# EAGLE design GTIA2DVI (EAGLE 9.6.2)
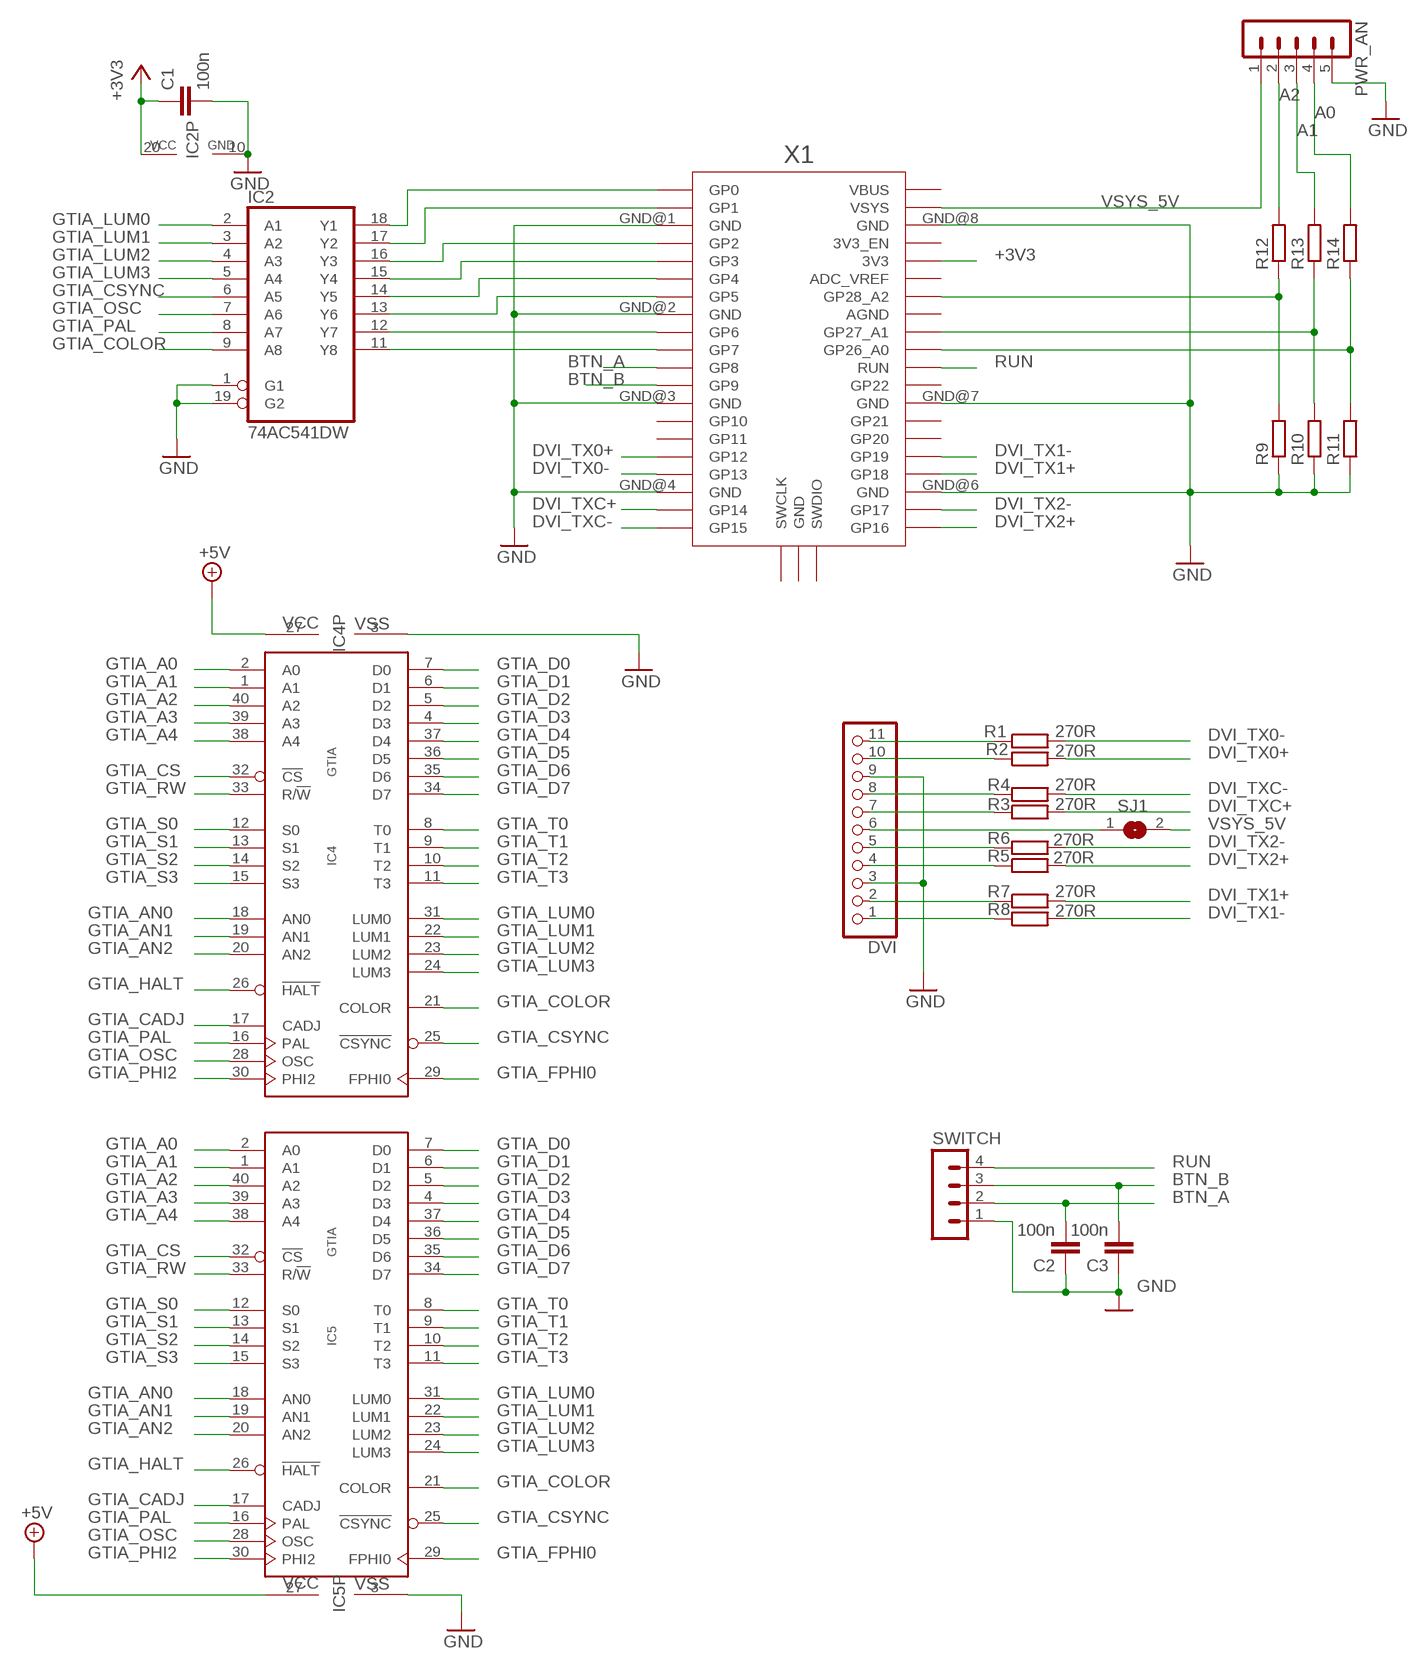
[diagram p0: schematic, sheet 1]

## Parts
C1  100n  C-EUC0805  [C0805]
C2  100n  C-EUC0805  [C0805]
C3  100n  C-EUC0805  [C0805]
DVI  PINHD-1X11  [1X11]
IC2  74AC541DW  [SO20W]
IC4  GTIA  [DIL40]
IC5  GTIA  [DIL40]
PWR_AN  MA05-1  [MA05-1]
R1  270R  R-EU_M0805  [M0805]
R2  270R  R-EU_M0805  [M0805]
R3  270R  R-EU_M0805  [M0805]
R4  270R  R-EU_M0805  [M0805]
R5  270R  R-EU_M0805  [M0805]
R6  270R  R-EU_M0805  [M0805]
R7  270R  R-EU_M0805  [M0805]
R8  270R  R-EU_M0805  [M0805]
R9  R-EU_M0805  [M0805]
R10  R-EU_M0805  [M0805]
R11  R-EU_M0805  [M0805]
R12  R-EU_M0805  [M0805]
R13  R-EU_M0805  [M0805]
R14  R-EU_M0805  [M0805]
SJ1  SJ  [SJ]
SWITCH  MA04-1  [MA04-1]
X1  RPI_PICO_IG-TH  [RPI_PICO_TH]

## Nets
+3V3: C1.1 IC2.20(VCC) X1.3V3
+5V: IC4.27(VCC) IC5.27(VCC)
A0: PWR_AN.4 R14.2
A1: PWR_AN.3 R13.2
A2: PWR_AN.2 R12.2
BTN_A: C2.2 SWITCH.2 X1.GP8
BTN_B: C3.2 SWITCH.3 X1.GP9
DVI_TX0+: R2.2 X1.GP12
DVI_TX0-: R1.2 X1.GP13
DVI_TX1+: R7.2 X1.GP18
DVI_TX1-: R8.2 X1.GP19
DVI_TX2+: R5.2 X1.GP16
DVI_TX2-: R6.2 X1.GP17
DVI_TXC+: R3.2 X1.GP14
DVI_TXC-: R4.2 X1.GP15
GND: C1.2 C2.1 C3.1 DVI.3 DVI.9 IC2.1(G1) IC2.10(GND) IC2.19(G2) IC4.3(VSS) IC5.3(VSS) PWR_AN.5 R9.1 R10.1 R11.1 SWITCH.1 X1.GND@1(GND) X1.GND@2(GND) X1.GND@3(GND) X1.GND@4(GND) X1.GND@6(GND) X1.GND@7(GND) X1.GND@8(GND)
GP0: IC2.18(Y1) X1.GP0
GP1: IC2.17(Y2) X1.GP1
GP2: IC2.16(Y3) X1.GP2
GP3: IC2.15(Y4) X1.GP3
GP4: IC2.14(Y5) X1.GP4
GP5: IC2.13(Y6) X1.GP5
GP6: IC2.12(Y7) X1.GP6
GP7: IC2.11(Y8) X1.GP7
GTIA_A0: IC4.2(A0) IC5.2(A0)
GTIA_A1: IC4.1(A1) IC5.1(A1)
GTIA_A2: IC4.40(A2) IC5.40(A2)
GTIA_A3: IC4.39(A3) IC5.39(A3)
GTIA_A4: IC4.38(A4) IC5.38(A4)
GTIA_AN0: IC4.18(AN0) IC5.18(AN0)
GTIA_AN1: IC4.19(AN1) IC5.19(AN1)
GTIA_AN2: IC4.20(AN2) IC5.20(AN2)
GTIA_CADJ: IC4.17(CADJ) IC5.17(CADJ)
GTIA_COLOR: IC2.9(A8) IC4.21(COLOR) IC5.21(COLOR)
GTIA_CS: IC4.32(!CS) IC5.32(!CS)
GTIA_CSYNC: IC2.6(A5) IC4.25(!CSYNC) IC5.25(!CSYNC)
GTIA_D0: IC4.7(D0) IC5.7(D0)
GTIA_D1: IC4.6(D1) IC5.6(D1)
GTIA_D2: IC4.5(D2) IC5.5(D2)
GTIA_D3: IC4.4(D3) IC5.4(D3)
GTIA_D4: IC4.37(D4) IC5.37(D4)
GTIA_D5: IC4.36(D5) IC5.36(D5)
GTIA_D6: IC4.35(D6) IC5.35(D6)
GTIA_D7: IC4.34(D7) IC5.34(D7)
GTIA_FPHI0: IC4.29(FPHI0) IC5.29(FPHI0)
GTIA_HALT: IC4.26(!HALT) IC5.26(!HALT)
GTIA_LUM0: IC2.2(A1) IC4.31(LUM0) IC5.31(LUM0)
GTIA_LUM1: IC2.3(A2) IC4.22(LUM1) IC5.22(LUM1)
GTIA_LUM2: IC2.4(A3) IC4.23(LUM2) IC5.23(LUM2)
GTIA_LUM3: IC2.5(A4) IC4.24(LUM3) IC5.24(LUM3)
GTIA_OSC: IC2.7(A6) IC4.28(OSC) IC5.28(OSC)
GTIA_PAL: IC2.8(A7) IC4.16(PAL) IC5.16(PAL)
GTIA_PHI2: IC4.30(PHI2) IC5.30(PHI2)
GTIA_RW: IC4.33(R/!W) IC5.33(R/!W)
GTIA_S0: IC4.12(S0) IC5.12(S0)
GTIA_S1: IC4.13(S1) IC5.13(S1)
GTIA_S2: IC4.14(S2) IC5.14(S2)
GTIA_S3: IC4.15(S3) IC5.15(S3)
GTIA_T0: IC4.8(T0) IC5.8(T0)
GTIA_T1: IC4.9(T1) IC5.9(T1)
GTIA_T2: IC4.10(T2) IC5.10(T2)
GTIA_T3: IC4.11(T3) IC5.11(T3)
N$1: DVI.11 R1.1
N$2: DVI.10 R2.1
N$3: DVI.8 R4.1
N$4: DVI.7 R3.1
N$5: DVI.5 R6.1
N$6: DVI.4 R5.1
N$7: DVI.2 R7.1
N$8: DVI.1 R8.1
N$18: R9.2 R12.1 X1.GP28_A2
N$19: R10.2 R13.1 X1.GP27_A1
N$20: R11.2 R14.1 X1.GP26_A0
RUN: SWITCH.4 X1.RUN
VSYS_5V: DVI.6 PWR_AN.1 SJ1.1 SJ1.2 X1.VSYS
Unconnected: X1.3V3_EN X1.ADC_VREF X1.AGND X1.GND@5(GND) X1.GP10 X1.GP11 X1.GP20 X1.GP21 X1.GP22 X1.SWCLK X1.SWDIO X1.VBUS

## Library data of the parts
C1-C3 = rcl:C-EU: CAPACITOR, European symbol; SPICEPREFIX: C
DVI = pinhead:PINHD-1X11: PIN HEADER
IC2 = 74xx-eu:74*541: Octal BUFFER and LINE DRIVER, 3-state
IC4 IC5 = eagle-6.5.0-atari:GTIA: GTIA
PWR_AN = con-lstb:MA05-1: PIN HEADER; OC_FARNELL: unknown; OC_NEWARK: unknown
R1-R14 = rcl:R-EU_: RESISTOR, European symbol; SPICEPREFIX: R
SJ1 = jumper:SJ: SMD solder JUMPER
SWITCH = con-lstb:MA04-1: PIN HEADER; OC_FARNELL: unknown; OC_NEWARK: unknown
X1 = RaspberryPi_Pico:RPI_PICO_IG

## Board
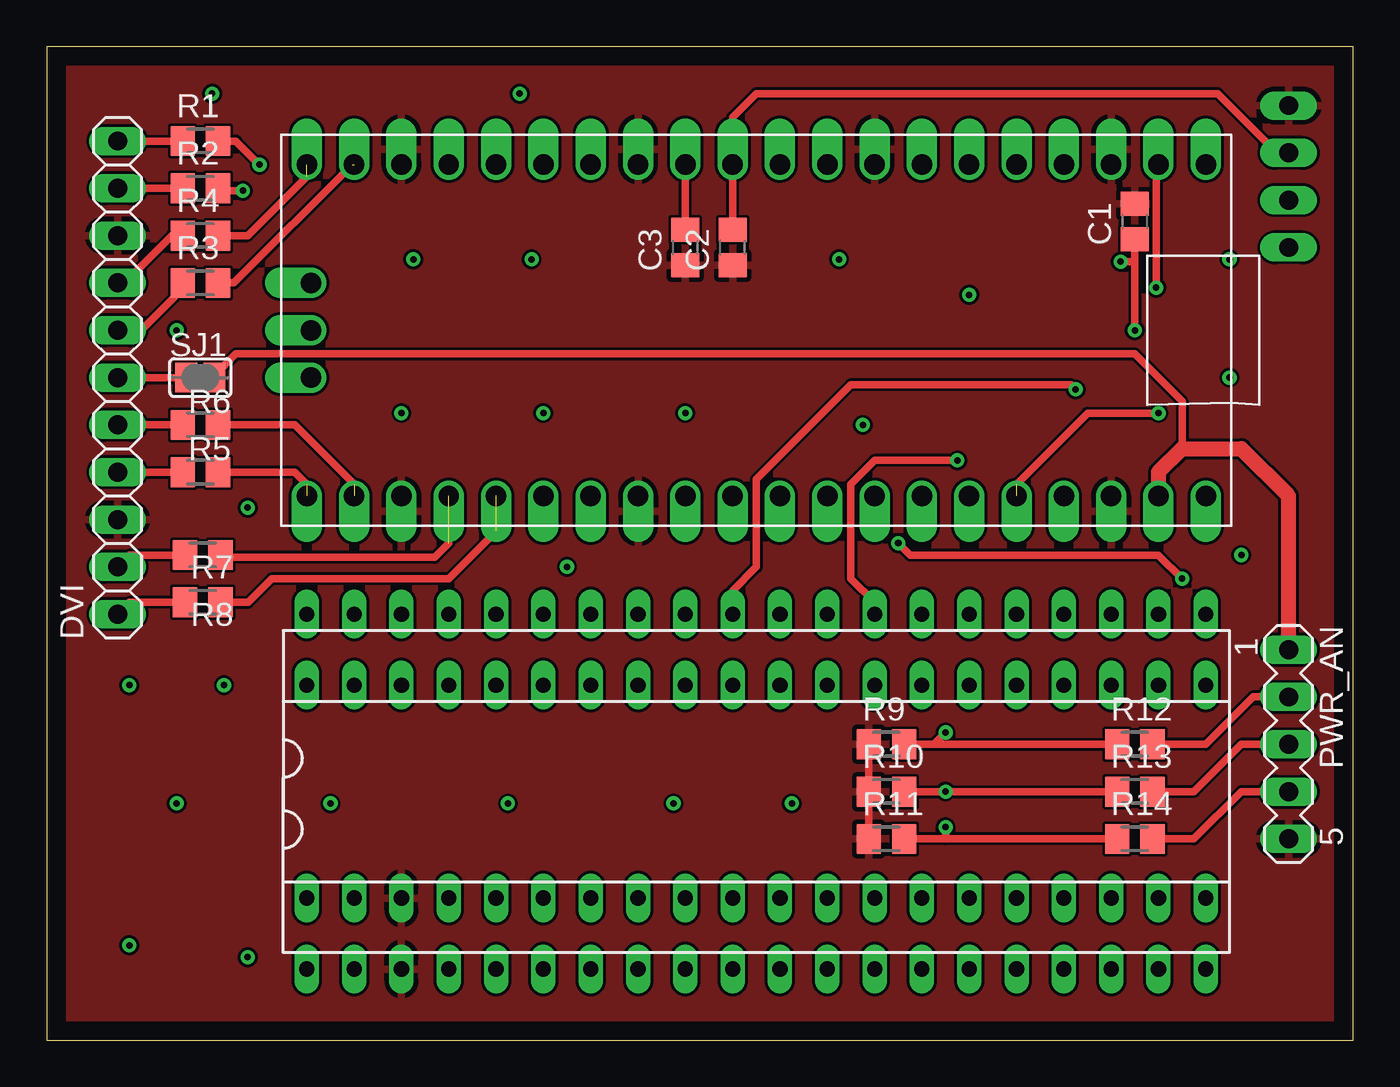
[diagram p1: board, top side]
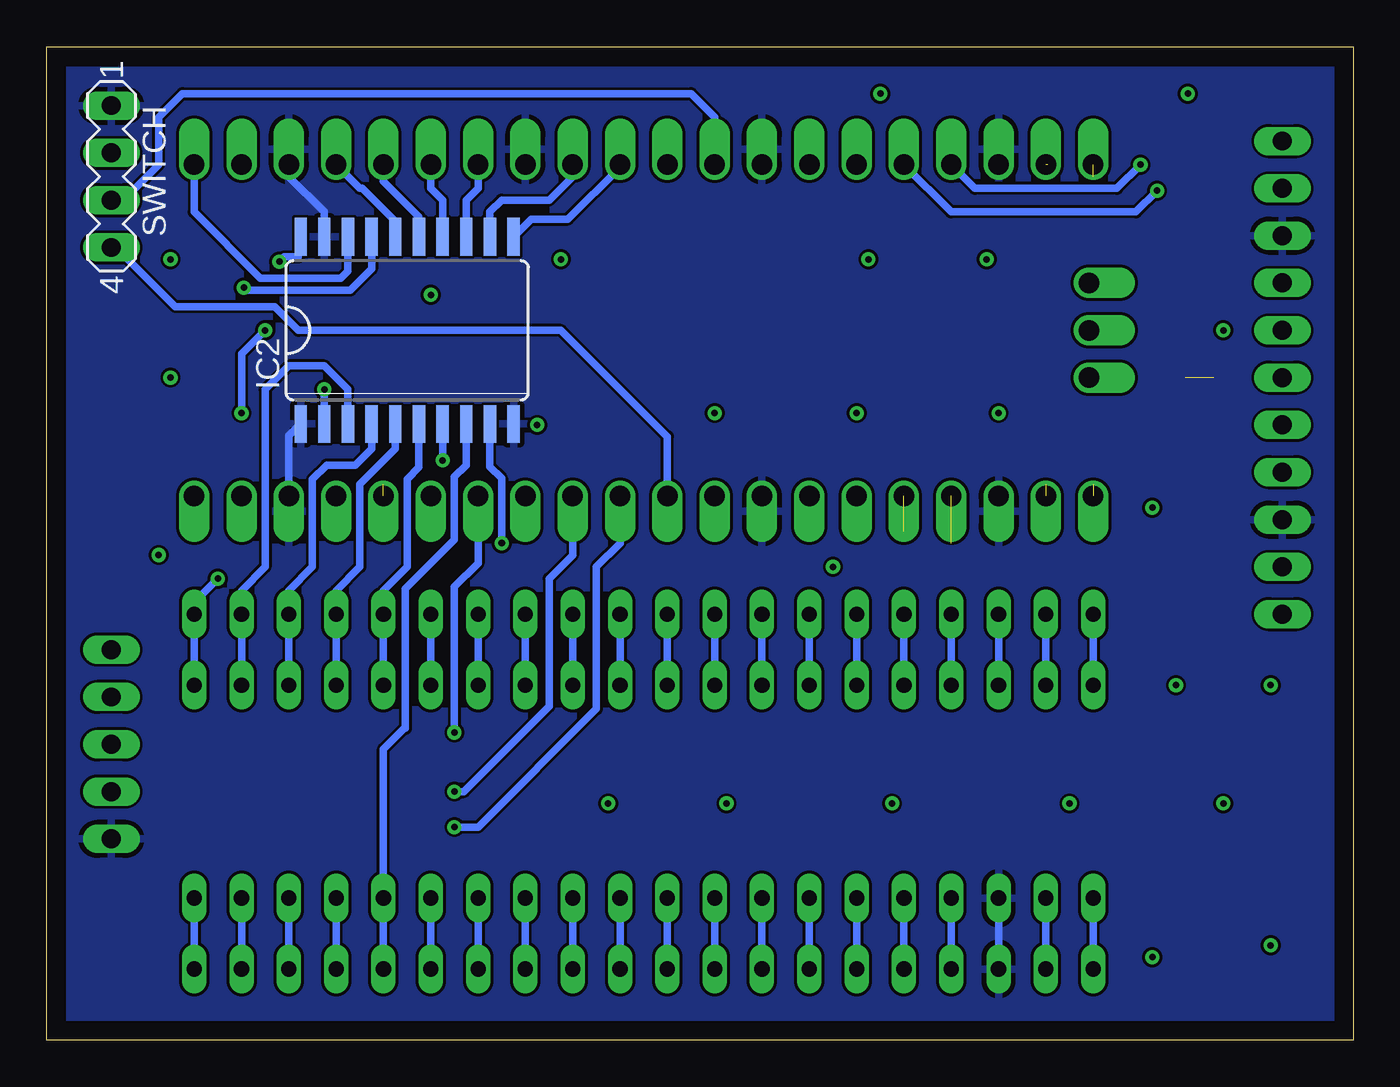
[diagram p2: board, bottom side, seen from below]

Size 70.16 x 53.33 mm. Coordinates in mm from the lower left corner, seen from the top.
Outline: 0,0 70.16,0 70.16,53.33 0,53.33 0,0
Copper layers (1*16): Top 0.035mm / dielectric 1.5mm / Bottom 0.035mm
Design rules "default": minimum track width 6mil, minimum drill 0.35mm, track to track 6mil, track to pad 6mil, pad to pad 6mil, via to via 6mil, smd to smd 6mil, copper to edge 40mil, drill to drill 6mil, minimum pad ring 10mil, minimum via ring 8mil, stop-mask expansion 4mil, vias tented up to drill 0mil, thermal gap 10mil

### Footprints (pad centres in the part's own frame; a part is rotated, then mirrored left to right if it is on the bottom)
C0805 = smd 1.3 x 1.5: 1 -0.95,0; 2 0.95,0
1X11 = drill 1.016 long: 1 -12.7,0; 2 -10.16,0; 3 -7.62,0; 4 -5.08,0; 5 -2.54,0; 6 0,0; 7 2.54,0; 8 5.08,0; 9 7.62,0; 10 10.16,0; 11 12.7,0
SO20W = smd 0.66 x 2.032: 1 -5.715,-5.029; 2 -4.445,-5.029; 3 -3.175,-5.029; 4 -1.905,-5.029; 5 -0.635,-5.029; 6 0.635,-5.029; 7 1.905,-5.029; 8 3.175,-5.029; 9 4.445,-5.029; 10 5.715,-5.029; 11 5.715,5.029; 12 4.445,5.029; 13 3.175,5.029; 14 1.905,5.029; 15 0.635,5.029; 16 -0.635,5.029; 17 -1.905,5.029; 18 -3.175,5.029; 19 -4.445,5.029; 20 -5.715,5.029
DIL40 = drill 0.813 long: 1 -24.13,-7.62; 2 -21.59,-7.62; 3 -19.05,-7.62; 4 -16.51,-7.62; 5 -13.97,-7.62; 6 -11.43,-7.62; 7 -8.89,-7.62; 8 -6.35,-7.62; 9 -3.81,-7.62; 10 -1.27,-7.62; 11 1.27,-7.62; 12 3.81,-7.62; 13 6.35,-7.62; 14 8.89,-7.62; 15 11.43,-7.62; 16 13.97,-7.62; 17 16.51,-7.62; 18 19.05,-7.62; 19 21.59,-7.62; 20 24.13,-7.62; 21 24.13,7.62; 22 21.59,7.62; 23 19.05,7.62; 24 16.51,7.62; 25 13.97,7.62; 26 11.43,7.62; 27 8.89,7.62; 28 6.35,7.62; 29 3.81,7.62; 30 1.27,7.62; 31 -1.27,7.62; 32 -3.81,7.62; 33 -6.35,7.62; 34 -8.89,7.62; 35 -11.43,7.62; 36 -13.97,7.62; 37 -16.51,7.62; 38 -19.05,7.62; 39 -21.59,7.62; 40 -24.13,7.62
MA05-1 = drill 1.016 long: 1 -5.08,0; 2 -2.54,0; 3 0,0; 4 2.54,0; 5 5.08,0
M0805 = smd 1.3 x 1.6: 1 -0.95,0; 2 0.95,0
SJ = smd 1.168 x 1.6: 1 -0.762,0; 2 0.762,0
MA04-1 = drill 1.016 long: 1 -3.81,0; 2 -1.27,0; 3 1.27,0; 4 3.81,0
RPI_PICO_TH = drill 1.1 pad 1.6 offset: 3V3 8.89,13.97; 3V3_EN 8.89,16.51; ADC_VREF 8.89,11.43; AGND 8.89,6.35; GND@1 -8.89,19.05; GND@2 -8.89,6.35; GND@3 -8.89,-6.35; GND@4 -8.89,-19.05; GND@5 0,-23.9; GND@6 8.89,-19.05; GND@7 8.89,-6.35; GND@8 8.89,19.05; GP0 -8.89,24.13; GP1 -8.89,21.59; GP2 -8.89,16.51; GP3 -8.89,13.97; GP4 -8.89,11.43; GP5 -8.89,8.89; GP6 -8.89,3.81; GP7 -8.89,1.27; GP8 -8.89,-1.27; GP9 -8.89,-3.81; GP10 -8.89,-8.89; GP11 -8.89,-11.43; GP12 -8.89,-13.97; GP13 -8.89,-16.51; GP14 -8.89,-21.59; GP15 -8.89,-24.13; GP16 8.89,-24.13; GP17 8.89,-21.59; GP18 8.89,-16.51; GP19 8.89,-13.97; GP20 8.89,-11.43; GP21 8.89,-8.89; GP22 8.89,-3.81; GP26_A0 8.89,1.27; GP27_A1 8.89,3.81; GP28_A2 8.89,8.89; RUN 8.89,-1.27; SWCLK -2.54,-23.9; SWDIO 2.54,-23.9; VBUS 8.89,24.13; VSYS 8.89,21.59

### Placement (x,y rotation side)
C1  58.42,43.94 90 top
C2  36.83,42.55 90 top
C3  34.29,42.55 90 top
DVI  3.81,35.56 90 top
IC2  50.8,38.1 0 bottom
IC4  38.1,15.24 0 top
IC5  38.1,11.43 0 top
PWR_AN  66.67,15.88 270 top
R1  8.26,48.26 0 top
R2  8.26,45.72 0 top
R3  8.26,40.64 0 top
R4  8.26,43.18 0 top
R5  8.26,30.48 0 top
R6  8.26,33.02 0 top
R7  8.38,26.03 0 top
R8  8.38,23.49 0 top
R9  45.09,15.88 0 top
R10  45.09,13.34 0 top
R11  45.09,10.8 0 top
R12  58.42,15.88 0 top
R13  58.42,13.34 0 top
R14  58.42,10.8 0 top
SJ1  8.26,35.56 0 top
SWITCH  66.67,46.36 270 bottom
X1  38.1,38.1 270 top

### Tracks (layer width: path | path; a pad name or v marks a point on that pad's centre or on a via)
+3V3  (via drill 0.35)  (1 unrouted)
  Top 0.406: 52.07,29.84 55.88,33.66 v59.69,33.66 | C1.1 58.42,41.78 | 58.42,41.78 v58.42,38.1 | v57.66,41.78 58.42,41.78
  Bottom 0.406: v59.69,33.66 59.69,36.83 v58.42,38.1 | IC2.20 56.64,43 56.64,42.04 57.4,42.04 v57.66,41.78
+5V
  Bottom 0.406: IC4.27 IC5.27
A0
  Top 0.406: PWR_AN.4 64.14,13.34 61.59,10.8 R14.2
A1
  Top 0.406: R13.2 61.59,13.34 64.14,15.88 PWR_AN.3
A2
  Top 0.406: PWR_AN.2 64.77,18.41 62.23,15.88 R12.2
BTN_A
  Top 0.406: SWITCH.2 66.04,47.62 62.87,50.8 38.1,50.8 36.83,49.53 X1.GP8 C2.2
BTN_B
  Top 0.406: C3.2 X1.GP9
  Bottom 0.406: SWITCH.3 66.04,45.08 64.14,46.99 64.14,49.53 62.87,50.8 35.56,50.8 34.29,49.53 X1.GP9
DVI_TX0+  (via drill 0.35)
  Top 0.406: R2.2 9.33,45.59 v10.54,45.59
  Bottom 0.406: v10.54,45.59 11.68,44.45 21.59,44.45 X1.GP12
DVI_TX0-  (via drill 0.35)
  Top 0.406: v11.43,46.99 10.16,48.26 R1.2
  Bottom 0.406: v11.43,46.99 12.7,45.72 20.32,45.72 X1.GP13
DVI_TX1+  (1 unrouted)
  Top 0.406: 21.59,26.67 20.83,25.91 9.71,25.91 9.59,26.03 R7.2
DVI_TX1-  (1 unrouted)
  Top 0.406: R8.2 10.82,23.49 12.09,24.77 21.59,24.77 24.13,27.3
DVI_TX2+  (1 unrouted)
  Top 0.406: 13.97,29.84 13.34,30.48 R5.2
DVI_TX2-  (1 unrouted)
  Top 0.406: 16.51,29.84 13.34,33.02 R6.2
DVI_TXC+  (1 unrouted)
  Top 0.406: 16.41,46.99 10.06,40.64 R3.2
DVI_TXC-  (1 unrouted)
  Top 0.406: 13.97,46.36 10.79,43.18 R4.2
GND
  Top 0.406: R9.1 R11.1
  Bottom 0.406: IC2.19 55.24,44.45 57.15,46.36 X1.GND@1 | IC2.1 57.15,32.44 X1.GND@8 | IC5.3 IC4.3 19.05,8.25
  pour Top: 0,52.7 69.85,52.7 69.85,0.63 0.64,0.63 0.64,52.07
  pour Bottom: 1.27,52.07 69.22,52.07 69.22,0.63 0.64,0.63 0.64,52.07
GP0
  Bottom 0.406: X1.GP0 62.23,44.45 58.67,40.89 54.36,40.89 53.98,41.27 IC2.18
GP1  (via drill 0.35)
  Top 0.406: X1.GP1 59.56,46.86 v59.56,40.39
  Bottom 0.406: v59.56,40.39 59.44,40.26 53.85,40.26 52.7,41.4 IC2.17
GP2
  Bottom 0.406: IC2.16 51.44,43.94 53.21,45.72 53.34,45.72 X1.GP2
GP3
  Bottom 0.406: IC2.15 50.16,44.2 52.07,46.1 X1.GP3
GP4
  Bottom 0.406: IC2.14 48.9,45.08 49.53,45.72 X1.GP4
GP5
  Bottom 0.406: IC2.13 47.62,45.08 46.99,45.72 X1.GP5
GP6
  Bottom 0.406: IC2.12 46.35,44.45 45.72,45.08 43.18,45.08 41.91,46.36 X1.GP6
GP7
  Bottom 0.406: IC2.11 44.15,44.07 42.16,44.07 39.37,46.86 X1.GP7
GTIA_A0
  Bottom 0.406: IC4.2 IC5.2
GTIA_A1
  Bottom 0.406: IC5.1 IC4.1
GTIA_A2
  Bottom 0.406: IC4.40 IC5.40
GTIA_A3
  Bottom 0.406: IC4.39 IC5.39
GTIA_A4
  Bottom 0.406: IC4.38 IC5.38
GTIA_AN0
  Bottom 0.406: IC4.18 IC5.18
GTIA_AN1
  Bottom 0.406: IC4.19 IC5.19
GTIA_AN2
  Bottom 0.406: IC4.20 IC5.20
GTIA_CADJ
  Bottom 0.406: IC5.17 IC4.17
GTIA_COLOR  (via drill 0.35)
  Top 0.406: v60.96,24.77 59.69,26.03 46.35,26.03 v45.72,26.67
  Bottom 0.406: v60.96,24.77 62.23,23.49 IC4.21 IC5.21 | v45.72,26.67 45.72,30.15 46.35,30.78 IC2.9
GTIA_CS
  Bottom 0.406: IC4.32 IC5.32
GTIA_CSYNC
  Bottom 0.406: IC2.6 50.16,30.73 50.8,30.1 50.8,25.4 52.07,24.13 IC4.25 IC5.25
GTIA_D0
  Bottom 0.406: IC5.7 IC4.7
GTIA_D1
  Bottom 0.406: IC4.6 IC5.6
GTIA_D2
  Bottom 0.406: IC4.5 IC5.5
GTIA_D3
  Bottom 0.406: IC4.4 IC5.4
GTIA_D4
  Bottom 0.406: IC4.37 IC5.37
GTIA_D5
  Bottom 0.406: IC4.36 IC5.36
GTIA_D6
  Bottom 0.406: IC4.35 IC5.35
GTIA_D7
  Bottom 0.406: IC4.34 IC5.34
GTIA_FPHI0
  Bottom 0.406: IC4.29 IC5.29
GTIA_HALT
  Bottom 0.406: IC4.26 IC5.26
GTIA_LUM0  (via drill 0.35)
  Top 0.406: v55.24,34.92 54.99,35.18 43.18,35.18 38.1,30.1 38.1,25.4 36.83,24.13 IC4.31
  Bottom 0.406: IC5.31 IC4.31 | IC2.2 v55.24,34.92
GTIA_LUM1
  Bottom 0.406: IC2.3 53.98,34.92 55.24,36.2 57.15,36.2 58.42,34.92 58.42,25.4 59.69,24.13 IC4.22 IC5.22
GTIA_LUM2
  Bottom 0.406: IC2.4 52.7,31.75 53.59,30.86 55.12,30.86 55.88,30.1 55.88,25.4 57.15,24.13 IC4.23 IC5.23
GTIA_LUM3
  Bottom 0.406: IC2.5 51.44,31.75 53.34,29.84 53.34,25.4 54.61,24.13 IC4.24 IC5.24
GTIA_OSC  (via drill 0.35)
  Top 0.406: v48.9,31.11 44.45,31.11 43.18,29.84 43.18,24.77 44.45,23.49 IC4.28
  Bottom 0.406: IC2.7 v48.9,31.11 | IC4.28 IC5.28
GTIA_PAL
  Bottom 0.406: IC2.8 47.62,30.86 48.26,30.23 48.26,26.86 50.9,24.23 50.9,16.73 50.93,16.76 52.07,15.62 IC4.16 IC5.16
GTIA_PHI2
  Bottom 0.406: IC4.30 IC5.30
GTIA_RW
  Bottom 0.406: IC4.33 IC5.33
GTIA_S0
  Bottom 0.406: IC4.12 IC5.12
GTIA_S1
  Bottom 0.406: IC5.13 IC4.13
GTIA_S2
  Bottom 0.406: IC4.14 IC5.14
GTIA_S3
  Bottom 0.406: IC5.15 IC4.15
GTIA_T0
  Bottom 0.406: IC4.8 IC5.8
GTIA_T1
  Bottom 0.406: IC5.9 IC4.9
GTIA_T2
  Bottom 0.406: IC4.10 IC5.10
GTIA_T3
  Bottom 0.406: IC4.11 IC5.11
N$1
  Top 0.406: DVI.11 R1.1
N$2
  Top 0.406: DVI.10 R2.1
N$3
  Top 0.406: DVI.8 4.19,40.64 6.73,43.18 R4.1
N$4
  Top 0.406: DVI.7 5.08,38.1 6.83,39.85 R3.1
N$5
  Top 0.406: R6.1 DVI.5
N$6
  Top 0.406: DVI.4 R5.1
N$7
  Top 0.406: R7.1 4.45,26.03 DVI.2
N$8
  Top 0.406: R8.1 4.45,23.49 DVI.1
N$18  (via drill 0.35)
  Top 0.406: R9.2 47.62,15.88 | 47.62,15.88 R12.1 | v48.26,16.51 47.62,15.88
  Bottom 0.406: v48.26,16.51 48.26,24.32 46.99,25.59 X1.GP28_A2
N$19  (via drill 0.35)
  Top 0.406: R13.1 v48.26,13.34 R10.2
  Bottom 0.406: X1.GP27_A1 41.91,26.03 43.18,24.77 43.18,17.91 47.75,13.34 v48.26,13.34
N$20  (via drill 0.35)
  Top 0.406: R14.1 48.26,10.8 | 48.26,10.8 R11.2 | v48.26,11.43 48.26,10.8
  Bottom 0.406: X1.GP26_A0 39.37,26.67 40.64,25.4 40.64,17.78 46.99,11.43 v48.26,11.43
N$26  (via drill 0.35)
  other vias: 19.68,41.91
N$27  (via drill 0.35)
  other vias: 26.04,41.91
N$29  (via drill 0.35)
  other vias: 42.55,41.91
N$30  (via drill 0.35)
  other vias: 19.05,33.66
N$31  (via drill 0.35)
  other vias: 26.67,33.66
N$32  (via drill 0.35)
  other vias: 34.29,33.66
N$33  (via drill 0.35)
  other vias: 43.81,33.02
N$35  (via drill 0.35)
  other vias: 49.53,40
N$36  (via drill 0.35)
  other vias: 8.89,50.8
N$37  (via drill 0.35)
  other vias: 25.4,50.8
N$38  (via drill 0.35)
  other vias: 63.5,41.91
N$39  (via drill 0.35)
  other vias: 63.5,35.56
N$40  (via drill 0.35)
  other vias: 4.45,19.05
N$41  (via drill 0.35)
  other vias: 9.53,19.05
N$42  (via drill 0.35)
  other vias: 4.45,5.08
N$43  (via drill 0.35)
  other vias: 10.79,4.44
N$44  (via drill 0.35)
  other vias: 6.99,12.7
N$45  (via drill 0.35)
  other vias: 15.24,12.7
N$46  (via drill 0.35)
  other vias: 24.77,12.7
N$47  (via drill 0.35)
  other vias: 33.66,12.7
N$48  (via drill 0.35)
  other vias: 40.01,12.7
N$50  (via drill 0.35)
  other vias: 27.94,25.4
N$51  (via drill 0.35)
  other vias: 10.79,28.57
N$52  (via drill 0.35)
  other vias: 6.99,38.1
N$53  (via drill 0.35)
  other vias: 64.14,26.03
RUN
  Bottom 0.406: X1.RUN 36.83,32.38 42.55,38.1 56.64,38.1 57.91,39.37 63.25,39.37 66.17,42.29 66.17,42.55 SWITCH.4
VSYS_5V  (2 unrouted)
  Top 0.406: 60.96,31.75 60.96,34.29 58.42,36.83 10.16,36.83 9.02,35.69 SJ1.2 | DVI.6 7.62,35.56
  Top 0.813: PWR_AN.1 66.67,29.21 64.14,31.75 60.96,31.75 59.69,30.48 X1.VSYS